# EAGLE design Zapalování_ARDUINO (EAGLE 7.5.0)
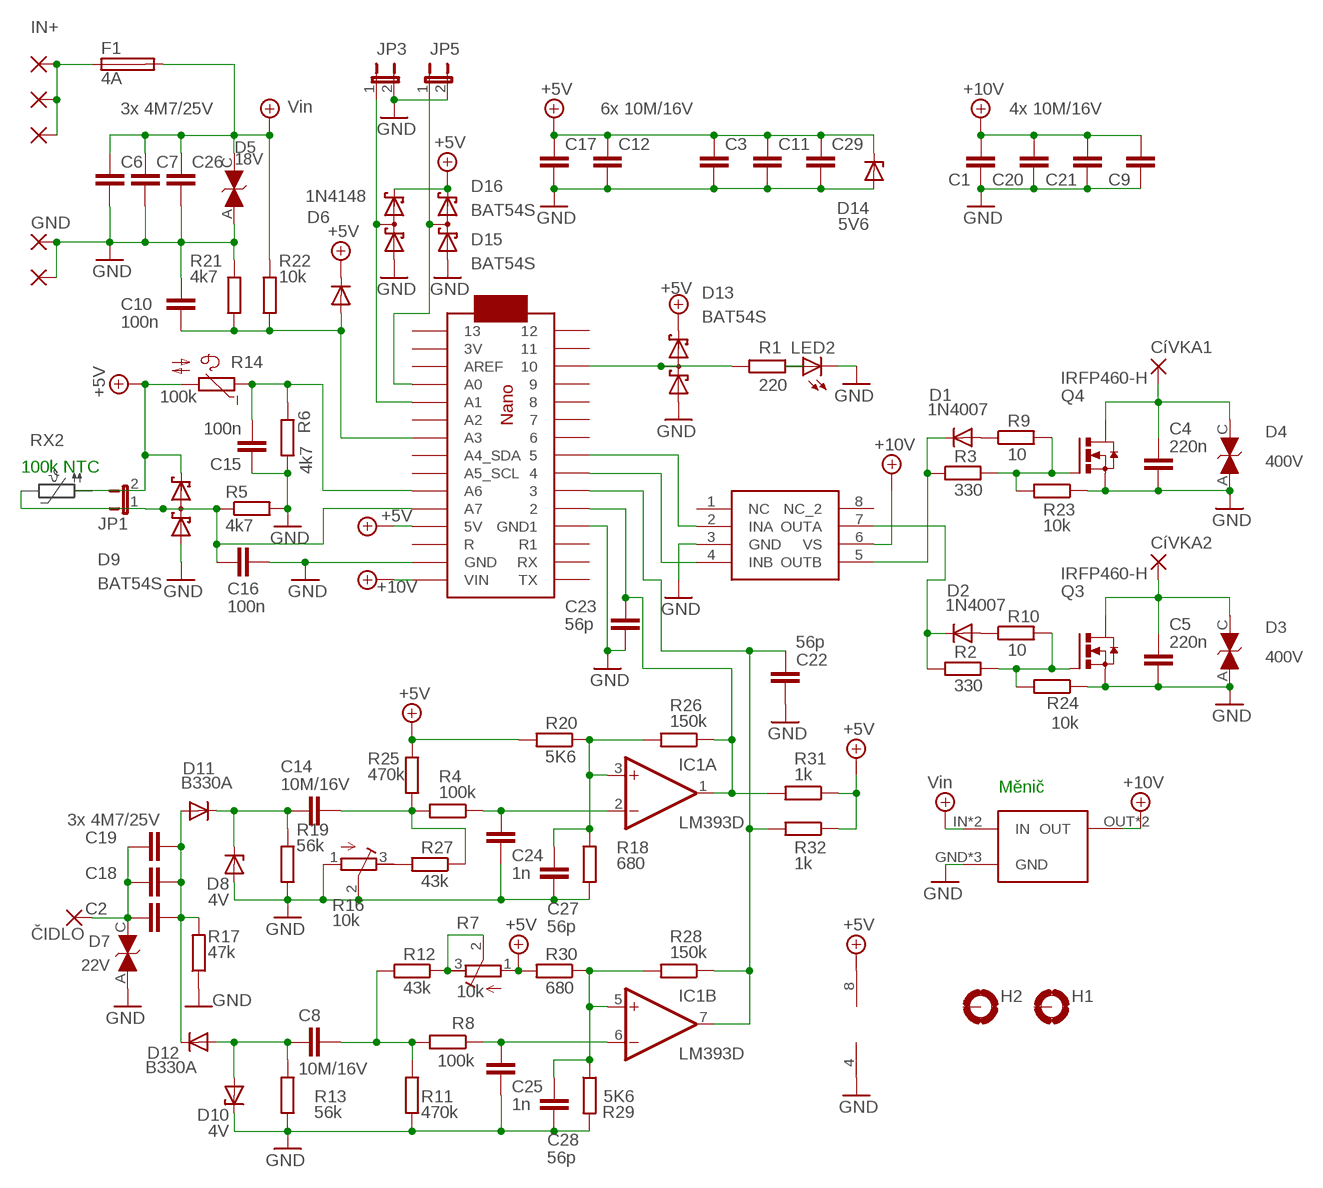
[diagram p0: schematic, sheet 1]

## Parts
C1  10M/16V  C-EUC1206K  [C1206K]
C2  3x 4M7/25V  C-EUC1206K  [C1206K]
C3  6x 10M/16V  C-EUC1206K  [C1206K]
C4  220n  C-EU150-054X183  [C150-054X183]
C5  220n  C-EU150-054X183  [C150-054X183]
C6  4M7/25V  C-EUC1206K  [C1206K]
C7  4M7/25V  C-EUC1206K  [C1206K]
C8  10M/16V  C-EUC1206K  [C1206K]
C9  10M/16V  C-EUC1206K  [C1206K]
C10  100n  C-EUC1206K  [C1206K]
C11  10M/16V  C-EUC1206K  [C1206K]
C12  10M/16V  C-EUC1206K  [C1206K]
C14  10M/16V  C-EUC1206K  [C1206K]
C15  100n  C-EUC1206K  [C1206K]
C16  100n  C-EUC1206K  [C1206K]
C17  10M/16V  C-EUC1206K  [C1206K]
C18  4M7/25V  C-EUC1206K  [C1206K]
C19  4M7/25V  C-EUC1206K  [C1206K]
C20  10M/16V  C-EUC1206K  [C1206K]
C21  4x 10M/16V  C-EUC1206K  [C1206K]
C22  56p  C-EUC1206K  [C1206K]
C23  56p  C-EUC1206K  [C1206K]
C24  1n  C-EUC1206K  [C1206K]
C25  1n  C-EUC1206K  [C1206K]
C26  3x 4M7/25V  C-EUC1206K  [C1206K]
C27  56p  C-EUC1206K  [C1206K]
C28  56p  C-EUC1206K  [C1206K]
C29  10M/16V  C-EUC1206K  [C1206K]
CIVKA+  3,81/1,4  [3,81/1,4]
CíVKA1  3,81/1,4  [3,81/1,4]
CíVKA2  3,81/1,4  [3,81/1,4]
CíVKA+  3,81/1,4  [3,81/1,4]
D1  1N4007  GF1  [SMA-DO214AC]
D2  1N4007  GF1  [SMA-DO214AC]
D3  400V  SMBJ  [SMC]
D4  400V  SMBJ  [SMC]
D5  18V  SMBJ  [SMC]
D6  1N4148  PMLL4150  [SOD80C]
D7  22V  SMBJ  [SMC]
D8  4V  ZENER-DIODESOD80C  [SOD80C]
D9  BAT54S  [SOT23]
D10  4V  ZENER-DIODESOD80C  [SOD80C]
D11  B330A  DIODE-DO214BA  [DO214BA]
D12  B330A  DIODE-DO214BA  [DO214BA]
D13  BAT54S  [SOT23]
D14  5V6  ZENER-DIODESOD80C  [SOD80C]
D15  BAT54S  [SOT23]
D16  BAT54S  [SOT23]
F1  4A  PICOFUSE  [PICOFUSE]
GND  3,81/1,4  [3,81/1,4]
GND28  3,81/1,4  [3,81/1,4]
H1  MOUNT-PAD-ROUND3.0  [3,0-PAD]
H2  MOUNT-PAD-ROUND3.0  [3,0-PAD]
IC1  LM393D  [SO08]
IN+  3,81/1,4  [3,81/1,4]
JP1  JP1E  [JP1]
JP3  JP1E  [JP1]
JP5  JP1E  [JP1]
LED2  LED5MM  [LED5MM]
Q3  IRFP460-H  IRFP240-H  [TO247BH]
Q4  IRFP460-H  IRFP240-H  [TO247BH]
R1  220  R-EU_M1206  [M1206]
R2  330  R-EU_M1206  [M1206]
R3  330  R-EU_M1206  [M1206]
R4  100k  R-EU_M1206  [M1206]
R5  4k7  R-EU_M1206  [M1206]
R6  4k7  R-EU_M1206  [M1206]
R7  10k  R-TRIMM64W  [RTRIM64W]
R8  100k  R-EU_M1206  [M1206]
R9  10  R-EU_M1206  [M1206]
R10  10  R-EU_M1206  [M1206]
R11  470k  R-EU_M1206  [M1206]
R12  43k  R-EU_M1206  [M1206]
R13  56k  R-EU_M1206  [M1206]
R14  100k  NTC640-9  [N640]
R16  10k  R-TRIMM64W  [RTRIM64W]
R17  47k  R-EU_M1206  [M1206]
R18  680  R-EU_M1206  [M1206]
R19  56k  R-EU_M1206  [M1206]
R20  5K6  R-EU_M1206  [M1206]
R21  4k7  R-EU_M1206  [M1206]
R22  10k  R-EU_M1206  [M1206]
R23  10k  R-EU_M1206  [M1206]
R24  10k  R-EU_M1206  [M1206]
R25  470k  R-EU_M1206  [M1206]
R26  150k  R-EU_M1206  [M1206]
R27  43k  R-EU_M1206  [M1206]
R28  150k  R-EU_M1206  [M1206]
R29  5K6  R-EU_M1206  [M1206]
R30  680  R-EU_M1206  [M1206]
R31  1k  R-EU_M1206  [M1206]
R32  1k  R-EU_M1206  [M1206]
U$1  ARDUINO_NANO  [ARDUINO_NANO]
U$2  IR25600/TC4427  IR23600  [SO08]
U$3  STEP:DOWN  [STEP-BOARD]
ČIDLO  3,81/1,4  [3,81/1,4]

## Nets
+5V: C3.1 C11.1 C12.1 C17.1 C29.1 D6.C D9.2(C2) D13.2(C2) D14.C D15.2(C2) D16.2(C2) IC1.8(P:V+) JP1.2 R7.1(A) R14.2 R20.2 R25.2 R30.2 R31.1 R32.1 U$1.P$23(5V)
+14V: C6.1 C7.1 C26.1 D5.C F1.2 R22.2 U$3.IN U$3.P$1(IN) ; supply symbol labelled Vin
+15V: C1.2 C9.1 C20.2 C21.2 U$1.P$20(VIN) U$2.6(VS) U$3.OUT U$3.P$2(OUT) ; supply symbol labelled +10V
CIVKA1: U$1.P$8 U$2.2(INA)
CIVKA2: U$1.P$9 U$2.4(INB)
GND: C1.1 C3.2 C4.2 C5.2 C6.2 C7.2 C9.2 C10.1 C11.2 C12.2 C15.1 C16.1 C17.2 C20.1 C21.1 C22.2 C23.2 C24.2 C25.2 C26.2 C27.2 C28.2 C29.2 D3.A D4.A D5.A D7.A D8.A D9.1(A1) D10.C D13.1(A1) D14.A D15.1(A1) D16.1(A1) GND28.1(P) GND.1(P) IC1.4(P:V-) JP3.2 JP5.2 LED2.K(C) Q3.S Q4.S R5.2 R6.2 R11.1 R13.1 R16.1(A) R16.2(S) R17.1 R18.1 R19.1 R21.2 R23.1 R24.1 R29.2 U$1.P$12(GND) U$1.P$21(GND1) U$2.3(GND) U$3.GND U$3.GND2(GND) U$3.P$3(GND)
INT1: C23.1 IC1.1(A:OUT) R26.1 R31.2 U$1.P$11
INT2: C22.1 IC1.7(B:OUT) R28.1 R32.2 U$1.P$10
N$1: Q4.G R3.2 R9.2 R23.2
N$3: D1.K(C) R3.1 U$2.5(OUTB)
N$4: C4.1 CíVKA1.1(P) D4.C Q4.D
N$5: Q3.G R2.2 R10.2 R24.2
N$6: D2.K(C) R2.1 U$2.7(OUTA)
N$7: D15.3(C1A2) JP3.1 U$1.P$30(A1)
N$8: D16.3(C1A2) JP5.1 U$1.P$31(A0)
N$9: D13.3(C1A2) R1.2 U$1.P$3
N$10: C16.2 D9.3(C1A2) JP1.1 R5.1 U$1.P$24(A7)
N$11: C28.1 IC1.5(B:+IN) R28.2 R29.1 R30.1
N$12: C24.1 IC1.2(A:-IN) R4.1
N$14: LED2.A R1.1
N$17: C27.1 IC1.3(A:+IN) R18.2 R20.1 R26.2
N$18: C2.2 C18.2 C19.2 D7.C ČIDLO.1(P)
N$19: C14.2 D8.C D11.C R19.2
N$21: C15.2 R6.1 R14.1 U$1.P$25(A6)
N$22: C2.1 C18.1 C19.1 D11.A D12.C R17.2
N$23: C25.1 IC1.6(B:-IN) R8.1
N$24: R7.2(S) R7.3(E) R12.1
N$25: C8.1 R8.2 R11.2 R12.2
N$26: R16.3(E) R27.2
N$27: C8.2 D10.A D12.A R13.2
N$29: D2.A R10.1
N$30: D1.A R9.1
N$35: C5.1 CíVKA2.1(P) D3.C Q3.D
N$38: C14.1 R4.2 R25.1 R27.1
N$45: C10.2 D6.A R21.1 R22.1 U$1.P$28(A3)
VIN: CIVKA+.1(P) CíVKA+.1(P) F1.1 IN+.1(P)
Unconnected: H1.B3,0(MOUNT) H2.B3,0(MOUNT) U$1.P$1 U$1.P$2 U$1.P$4 U$1.P$5 U$1.P$6 U$1.P$7 U$1.P$13(R) U$1.P$14(RX) U$1.P$15(TX) U$1.P$22(R1) U$1.P$26(A5_SCL) U$1.P$27(A4_SDA) U$1.P$29(A2) U$1.P$32(AREF) U$1.P$33(3V) U$1.P$34 U$2.1(NC) U$2.8(NC_2)

## Notes on the sheet
- 100k NTC
- Měnič

## Library data of the parts
C1-C12 C14-C29 = rcl:C-EU: CAPACITOR, European symbol
CIVKA+ CíVKA1 CíVKA2 CíVKA+ GND GND28 IN+ ČIDLO = wirepad:3,81/1,4: THROUGH-HOLE PAD
D1 D2 = diode:GF1: DIODE
D3-D5 D7 = transils:SMBJ: Transil SMC
D6 = diode:PMLL4150: DIODE high speed
D8 D10 D14 = diode:ZENER-DIODE: Z-Diode
D9 D13 D15 D16 = diode:BAT54S: Schottky Diodes Pin connection corrected 2011-05-04 Source: Fairchild .. BAT54.pdf
D11 D12 = diode:DIODE-: DIODE
F1 = fuse:PICOFUSE: PICOFUSE 19275, Wickmann; OC_FARNELL: unknown; OC_NEWARK: unknown
H1 H2 = holes:MOUNT-PAD-ROUND: MOUNTING PAD, round
IC1 = linear:LM393: COMPARATOR
JP1 JP3 JP5 = jumper:JP1E: JUMPER
LED2 = led:LED: LED OSRAM: - CHIPLED LG R971, LG N971, LY N971, LG Q971, LY Q971, LO R971, LY R971 LH N974, LH R974 LS Q976, LO Q976, LY Q976 LO Q996 - Hyper CHIPLED LW Q18S LB Q993, LB Q99A, LB R99A - SideLED LS A670, LO A670, LY A670, LG A670, LP A670 LB A673, LV A673, LT A673, LW A673 LH A674 LY A675 LS A676, LA A676, LO A676, LY A676, LW A676 LS A679, LY A679, LG A679 - Hyper Micro SIDELED® LS Y876, LA Y876, LO Y876, LY Y876 LT Y87S - SmartLED LW L88C, LW L88S LB L89C, LB L89S, LG L890 LS L89K, LO L89K, LY L89K LS L896, LA L896, LO L896, LY L896 - TOPLED LS T670, LO T670, LY T670, LG T670, LP T670 LSG T670, LSP T670, LSY T670, LOP T670, LYG T670 LG T671, LOG T671, LSG T671 LB T673, LV T673, LT T673, LW T673 LH T674 LS T676, LA T676, LO T676, LY T676, LB T676, LH T676, LSB T676, LW T676 LB T67C, LV T67C, LT T67C, LS T67K, LO T67K, LY T67K, LW E67C LS E67B, LA E67B, LO E67B, LY E67B, LB E67C, LV E67C, LT E67C LW T67C LS T679, LY T679, LG T679 LS T770, LO T770, LY T770, LG T770, LP T770 LB T773, LV T773, LT T773, LW T773 LH T774 LS E675, LA E675, LY E675, LS T675 LS T776, LA T776, LO T776, LY T776, LB T776 LHGB T686 LT T68C, LB T68C - Hyper Mini TOPLED® LB M676 - Mini TOPLED Santana® LG M470 LS M47K, LO M47K, LY M47K Source: http://www.osram.convergy.de LUXEON: - LUMILED® LXK2-PW12-R00, LXK2-PW12-S00, LXK2-PW14-U00, LXK2-PW14-V00 LXK2-PM12-R00, LXK2-PM12-S00, LXK2-PM14-U00 LXK2-PE12-Q00, LXK2-PE12-R00, LXK2-PE12-S00, LXK2-PE14-T00, LXK2-PE14-U00 LXK2-PB12-K00, LXK2-PB12-L00, LXK2-PB12-M00, LXK2-PB14-N00, LXK2-PB14-P00, LXK2-PB14-Q00 LXK2-PR12-L00, LXK2-PR12-M00, LXK2-PR14-Q00, LXK2-PR14-R00 LXK2-PD12-Q00, LXK2-PD12-R00, LXK2-PD12-S00 LXK2-PH12-R00, LXK2-PH12-S00 LXK2-PL12-P00, LXK2-PL12-Q00, LXK2-PL12-R00 Source: www.luxeon.com KINGBRIGHT: KA-3528ASYC Source: www.kingbright.com
Q3 Q4 = transistor-power:IRFP240: HEXFET Power MosFet Source: http://www.irf.com/
R1-R6 R8-R13 R17-R32 = rcl:R-EU_: RESISTOR, European symbol
R7 R16 = rcl:R-TRIMM: Trimm resistor
R14 = ptc-ntc:NTC640-9: PHILIPS NTC; OC_FARNELL: unknown; OC_NEWARK: unknown
U$1 = 00cmeldas:ARDUINO_NANO
U$2 = 00cmeldas:IR23600
U$3 = 00cmeldas:STEP:DOWN

## Board
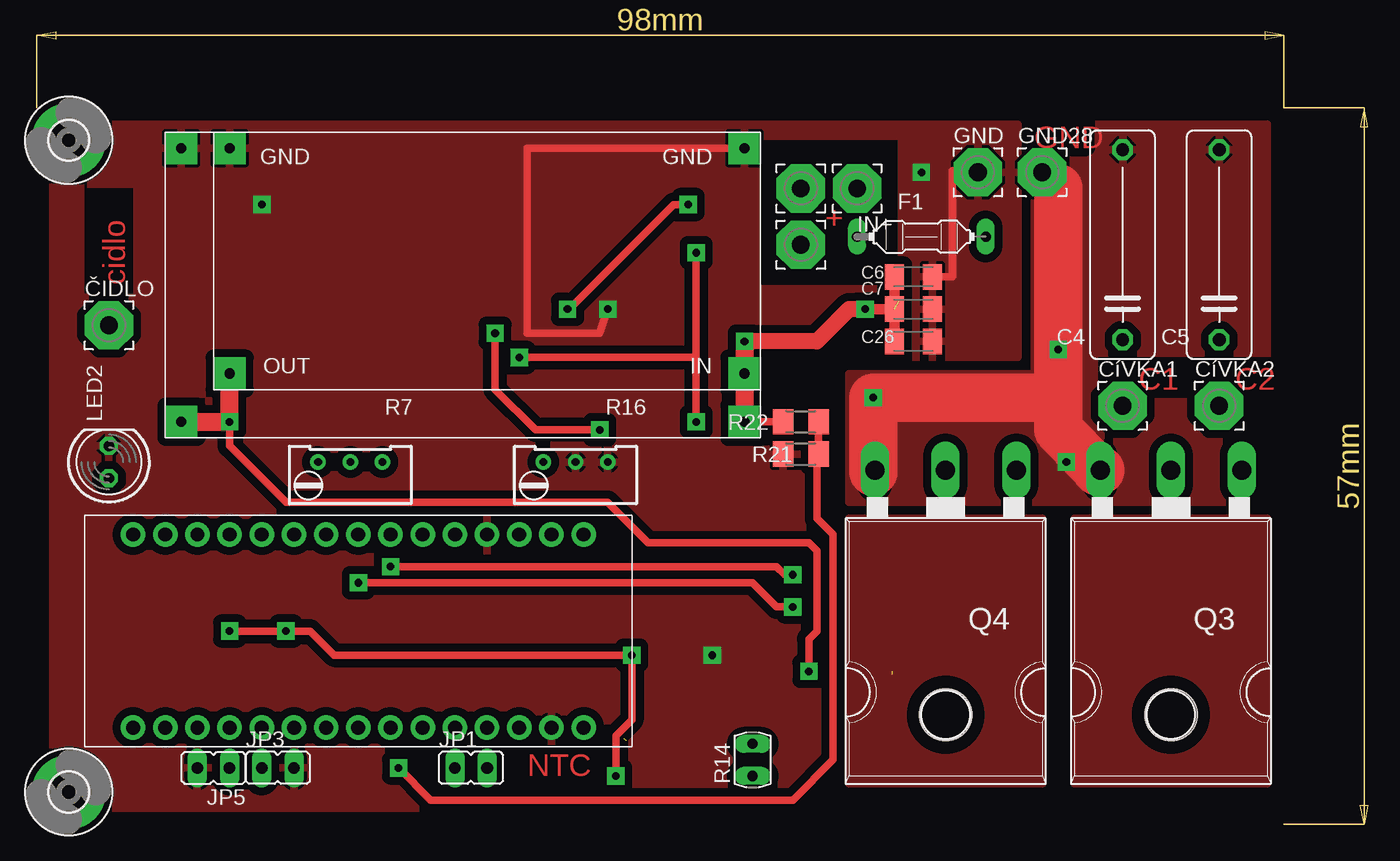
[diagram p1: board, top side]
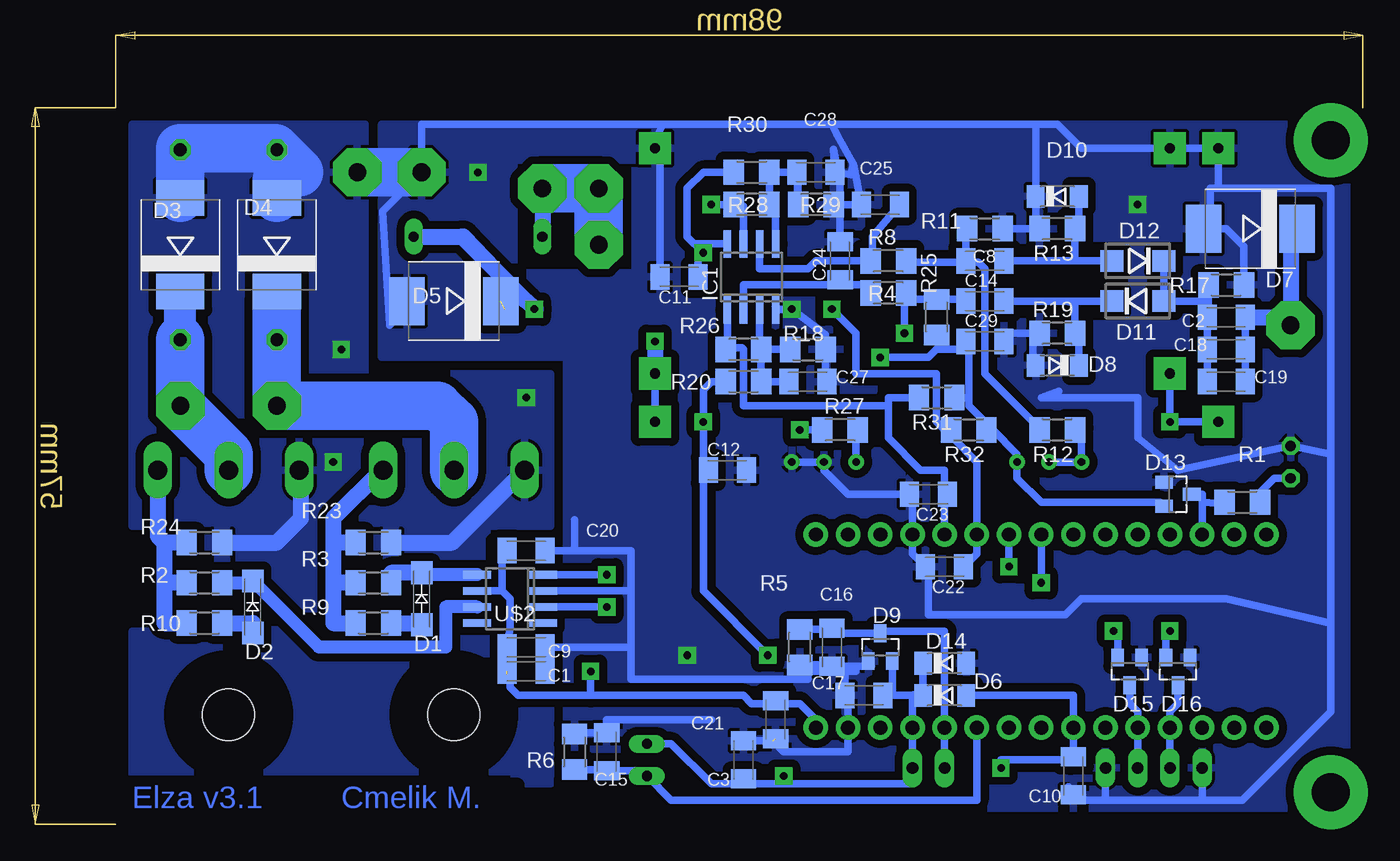
[diagram p2: board, bottom side, seen from below]

Size 105.07 x 62.53 mm. Coordinates in mm from the lower left corner, seen from the top.
Copper layers (1*16): Top 0.035mm / dielectric 1.5mm / Bottom 0.035mm
Design rules "default *": minimum track width 10mil, minimum drill 24mil, track to track 25mil, track to pad 35mil, pad to pad 12mil, via to via 12mil, smd to smd 8mil, copper to edge 40mil, drill to drill 8mil, minimum pad ring 12mil, minimum via ring 15mil, stop-mask expansion 4mil, vias tented up to drill 0mil, thermal gap 10mil
tRestrict: area 3.8,41.9 to 7.6,50.2; area 78.7,53.3 to 83.2,55.2; area 83.8,33.7 to 97.8,36.8; area 57.2,42.5 to 67.9,54
bRestrict: area 67.3,0.6 to 97.8,3.8; area 57.8,43.8 to 66.7,52.1

### Footprints (pad centres in the part's own frame; a part is rotated, then mirrored left to right if it is on the bottom)
C1206K = smd 1.5 x 2: 1 -1.5,0; 2 1.5,0
C150-054X183 = drill 1.016 octagon: 1 -7.493,0; 2 7.493,0
3,81/1,4 = drill 1.397 pad 3.81 octagon: 1 0,0
SMA-DO214AC = smd 1.8 x 1.7: A -2.05,0; K 2.05,0
SMC = smd 2.8 x 3.8: A 3.7,0; C -3.7,0
SOD80C = smd 1.4 x 1.8: A 1.7,0; C -1.7,0
SOT23 = smd 1 x 1.4: 1 -0.95,-1.1; 2 0.95,-1.1; 3 0,1.1
DO214BA = smd 1.8 x 1.7: A 2.05,0; C -2.05,0
PICOFUSE = drill 0.813 long: 1 -5.08,0; 2 5.08,0
3,0-PAD = drill 3 pad 5.842: B3,0 0,0
SO08 = smd 0.6 x 2.2: 1 -1.905,-2.6; 2 -0.635,-2.6; 3 0.635,-2.6; 4 1.905,-2.6; 5 1.905,2.6; 6 0.635,2.6; 7 -0.635,2.6; 8 -1.905,2.6
JP1 = drill 0.914 long: 1 0,-1.27; 2 0,1.27
LED5MM = drill 0.813 octagon: A -1.27,0; K 1.27,0
TO247BH = drill 1.499 long: D 0,-10.16; G -5.588,-10.16; S 5.588,-10.16 | hole 4.115: 0,9.144
M1206 = smd 1.6 x 2: 1 -1.4,0; 2 1.4,0
RTRIM64W = drill 0.61: 1 1.27,-2.54; 2 1.27,0; 3 1.27,2.54
N640 = drill 0.813 long: 1 -1.27,0; 2 1.27,0
ARDUINO_NANO = drill 1.1 pad 1.93: P$1 -20.32,7.62; P$2 -17.78,7.62; P$3 -15.24,7.62; P$4 -12.7,7.62; P$5 -10.16,7.62; P$6 -7.62,7.62; P$7 -5.08,7.62; P$8 -2.54,7.62; P$9 0,7.62; P$10 2.54,7.62; P$11 5.08,7.62; P$12 12.7,-7.62; P$13 10.16,-7.62; P$14 12.7,7.62; P$15 15.24,7.62; P$20 15.24,-7.62; P$21 7.62,7.62; P$22 10.16,7.62; P$23 7.62,-7.62; P$24 5.08,-7.62; P$25 2.54,-7.62; P$26 0,-7.62; P$27 -2.54,-7.62; P$28 -5.08,-7.62; P$29 -7.62,-7.62; P$30 -10.16,-7.62; P$31 -12.7,-7.62; P$32 -15.24,-7.62; P$33 -17.78,-7.62; P$34 -20.32,-7.62
SO08' = smd 0.6 x 2.2: 1 -1.905,-2.6; 2 -0.635,-2.6; 3 0.635,-2.6; 4 1.905,-2.6; 5 1.905,2.6; 6 0.635,2.6; 7 -0.635,2.6; 8 -1.905,2.6; 9 1.905,2.6
STEP-BOARD = drill 0.8 pad 2.54 square: GND -7.62,-7.62; GND2 33.02,-7.62; IN -7.62,10.16; OUT 33.02,10.16; P$1 -7.62,13.97; P$2 36.83,13.97; P$3 36.83,-7.62

### Placement (x,y rotation side)
C1  66.04,13.97 180 bottom
C2  10.8,40.01 0 bottom
C3  48.9,5.08 90 bottom
C4  85.72,45.72 90 top
C5  93.34,45.72 90 top
C6  69.21,43.18 0 top
C7  69.21,40.64 0 top
C8  29.84,44.45 0 bottom
C9  66.04,12.06 0 bottom
C10  22.86,3.81 90 bottom
C11  53.98,43.18 180 bottom
C12  50.16,27.94 0 bottom
C14  29.84,41.27 0 bottom
C15  59.69,5.71 270 bottom
C16  41.91,13.97 90 bottom
C17  39.37,10.16 180 bottom
C18  10.8,37.47 0 bottom
C19  10.8,34.92 0 bottom
C20  66.04,21.59 180 bottom
C21  46.36,8.26 90 bottom
C22  33.02,20.32 180 bottom
C23  34.29,26.04 180 bottom
C24  41.27,44.45 90 bottom
C25  38.1,48.9 180 bottom
C26  69.21,38.1 0 top
C27  43.81,34.92 0 bottom
C28  43.18,51.44 0 bottom
C29  29.84,38.1 0 bottom
CIVKA+  60.33,50.16 0 top
CíVKA1  85.72,33.02 0 top
CíVKA2  93.34,33.02 0 top
CíVKA+  60.33,45.72 0 top
D1  74.29,17.78 90 bottom
D2  87.63,17.14 90 bottom
D3  93.34,45.72 90 bottom
D4  85.72,45.72 90 bottom
D5  71.75,41.27 180 bottom
D6  33.02,10.16 0 bottom
D7  8.89,46.99 180 bottom
D8  24.13,36.2 180 bottom
D9  38.1,13.97 0 bottom
D10  24.13,49.53 0 bottom
D11  17.78,41.27 0 bottom
D12  17.78,44.45 180 bottom
D13  14.61,26.04 270 bottom
D14  33.02,12.7 0 bottom
D15  18.41,12.06 180 bottom
D16  14.61,12.06 180 bottom
F1  69.85,46.35 0 top
GND  74.29,51.44 0 top
GND28  79.38,51.44 0 top
H1  2.54,53.98 0 top
H2  2.54,2.54 0 top
IC1  48.26,43.18 0 bottom
IN+  64.77,50.16 0 top
JP1  34.29,4.45 270 top
JP3  19.05,4.45 270 top
JP5  13.97,4.45 90 top
LED2  5.72,28.57 90 top
Q3  89.53,17.78 180 top
Q4  71.75,17.78 180 top
R1  9.52,25.4 180 bottom
R2  91.44,19.05 180 bottom
R3  78.1,19.05 180 bottom
R4  37.47,41.91 0 bottom
R5  44.45,13.97 270 bottom
R6  62.23,5.71 90 bottom
R7  24.77,27.3 90 top
R8  37.47,44.45 0 bottom
R9  78.1,15.88 180 bottom
R10  91.44,15.88 180 bottom
R11  29.84,46.99 180 bottom
R12  24.13,31.11 180 bottom
R13  24.13,46.99 0 bottom
R14  56.52,5.08 90 top
R16  42.55,27.3 90 top
R17  10.8,42.55 180 bottom
R18  43.81,37.47 180 bottom
R19  24.13,38.73 0 bottom
R20  48.9,34.92 180 bottom
R21  60.33,29.21 180 top
R22  60.33,31.75 180 top
R23  78.1,22.23 180 bottom
R24  91.44,22.23 180 bottom
R25  33.66,40.01 270 bottom
R26  48.9,37.47 0 bottom
R27  41.27,31.11 0 bottom
R28  48.26,48.9 0 bottom
R29  43.18,48.9 0 bottom
R30  48.26,51.44 180 bottom
R31  33.66,33.66 180 bottom
R32  31.12,31.11 180 bottom
U$1  27.94,15.24 0 top
U$2  IR25600/TC4427  [SO08']  67.31,17.78 90 bottom
U$3  48.26,45.72 180 top
ČIDLO  5.72,39.37 0 top

### Tracks (layer width: path | path; a pad name or v marks a point on that pad's centre or on a via)
+5V  (via drill 0.6)
  Top 0.61: v45.72,3.81 45.72,6.99 46.99,8.26 v46.99,13.34 23.5,13.34 21.59,15.24 v19.69,15.24 v15.24,15.24 | v38.1,36.83 52.07,36.83 | v52.07,45.09 52.07,36.83 | 52.07,36.83 v52.07,31.75
  Bottom 0.61: C17.1 37.47,10.16 | 35.71,10.16 35.56,10.16 | 35.71,10.16 37.47,10.16 | 37.47,10.16 37.15,10.48 D9.2 | 45.72,3.17 35.56,3.17 JP1.2 | 45.72,3.17 48.9,3.17 | 48.9,3.17 C3.1 | C3.1 48.9,3.81 | 35.56,10.16 D6.C D14.C | 35.71,10.16 35.08,10.31 | 48.9,3.17 51.44,3.17 54.61,6.35 R14.2 | v45.72,3.81 45.72,3.17 | 33.66,37.47 34.29,36.83 v38.1,36.83 | 52.07,27.94 v52.07,31.75 52.07,34.29 51.44,34.92 R20.2 | 52.07,27.94 52.07,18.41 v46.99,13.34 | JP1.2 35.56,5.08 | R25.2 33.52,38.6 | 33.52,38.6 33.66,38.73 | 33.52,38.6 33.02,38.1 33.66,37.47 | 33.66,37.47 31.75,37.47 C29.1 31.12,37.7 31.12,33.66 | 35.56,10.16 U$1.P$23 JP1.2 | C3.1 49.12,3.58 49.53,3.17 51.03,3.17 | 31.12,33.66 31.12,33.02 29.84,31.75 R32.1 29.21,31.11 27.3,29.21 R7.1 27.3,27.3 25.4,25.4 16.02,25.4 D13.2 | IC1.8 52.65,45.78 v52.07,45.09 | R30.2 52.07,51.44 53.34,50.16 53.34,46.35 v52.07,45.09 | C11.1 52.48,45.31 v52.07,45.09 | R31.1 31.12,33.66 | C12.1 52.07,27.94 | D15.2 19.37,14.92 v19.69,15.24 | D16.2 15.55,14.93 v15.24,15.24
+14V  (via drill 0.6)  (1 unrouted)
  Top 0.61: 59.05,31.75 R22.2 U$3.P$1
  Top 0.813: C26.1 C7.1 | C7.1 C6.1 | C7.1 v65.4,40.64
  Top 1.27: v65.4,40.64 64.13,40.64 61.6,38.1 v55.88,38.1
  Top 1.422: v55.88,38.1 U$3.IN U$3.P$1
  Bottom 0.61: U$3.P$1 U$3.IN
  Bottom 1.27: v65.4,40.64 65.27,40.64 66.04,41.27 68.58,43.81 | v55.88,38.1 U$3.IN | 71.12,46.35 70.99,46.35 68.58,43.81 | F1.2 71.12,46.35 | 68.58,43.81 71.12,46.35
+15V  (via drill 0.6)  (1 unrouted)
  Top 0.61: v15.24,31.75 15.24,29.84 19.69,25.4 45.09,25.4 48.26,22.23 60.96,22.23 61.6,21.59 61.6,15.24 60.96,14.61 v60.96,12.06
  Top 1.422: U$3.P$2 v15.24,31.75 U$3.OUT
  Bottom 0.61: 45.49,9.53 48.26,9.53 48.9,10.16 49.53,10.16 60.96,10.16 | 60.96,10.16 66.67,10.16 67.31,10.79 67.31,11.2 67.54,11.84 | 67.94,18.41 67.31,17.78 67.31,15.47 C1.2 C9.1 | 67.94,18.41 U$2.6 | C20.2 67.94,21.18 67.94,18.41 | C21.2 45.49,9.53 | 45.49,9.53 44.45,9.53 43.18,8.26 U$1.P$20 | U$3.OUT v15.24,31.75 U$3.P$2 | v60.96,12.06 60.96,10.16
CIVKA1  (via drill 0.6 pad 0.61)
  Top 0.61: v25.4,19.05 56.52,19.05 58.42,17.14 v59.69,17.14
  Bottom 0.61: U$1.P$8 v25.4,19.05 | v59.69,17.14 U$2.2
CIVKA2  (via drill 0.6 pad 0.61)
  Top 0.61: v59.69,19.68 59.05,19.68 58.42,20.32 v27.94,20.32
  Bottom 0.61: U$2.4 v59.69,19.68 | v27.94,20.32 U$1.P$9
GND  (via drill 0.6)  (1 unrouted)
  Top 0.61: C6.2 72.28,43.18 72.28,51.55 GND.1 | v45.09,40.64 44.45,38.73 38.73,38.73 38.73,53.34 U$3.GND
  Top 3.81: 80.64,31.11 83.82,27.94 83.82,27.81 | 83.82,27.81 Q3.S | 83.82,27.81 80.64,31.11 | 80.64,31.11 80.64,33.66 | 80.64,33.66 v66.04,33.66 66.04,27.81 | 80.64,33.66 v80.64,37.47 80.64,50.16
  Bottom 0.61: 26.04,38.73 27.94,38.73 28.35,38.33 C29.2 | R6.2 62.13,7.21 C15.1 59.69,8.26 51.44,8.26 | D9.1 38.81,12.47 C16.1 40.23,12.47 40.64,12.06 | D5.A 75.56,40.64 76.83,39.37 77.36,48.37 GND.1 74.29,55.24 55.24,55.24 | 57.79,13.97 C1.1 C9.2 | 57.79,13.97 57.79,18.41 | 57.79,18.41 57.79,21.59 62.23,21.59 | 62.23,21.59 62.23,24.02 | 40.01,12.06 40.64,12.06 | 40.64,12.06 43.81,12.06 | 57.79,13.97 57.79,11.43 43.81,11.43 43.81,12.06 | C20.1 62.23,21.59 | JP3.2 20.32,1.91 | 20.32,1.91 12.7,1.91 | 12.7,1.91 JP5.2 | 12.7,1.91 9.52,1.91 2.54,8.89 2.54,15.88 | 2.54,15.88 2.54,29.21 | 2.54,29.21 2.54,50.16 11.43,50.16 | D7.A 12.38,47.12 | 12.38,47.12 12.07,46.35 12.07,50.16 11.43,50.16 | 11.43,50.16 U$3.P$3 U$3.GND2 22.23,53.34 24.13,55.24 26.04,55.24 | R17.1 9.39,45.59 10.8,46.99 12.25,46.99 12.38,47.12 | R19.1 26.04,38.73 | 26.04,38.73 26.04,36.4 D8.A | D10.C 25.83,47.29 R13.1 | D10.C 25.83,47.42 25.4,46.99 R11.1 28.35,47.09 | C3.2 46.59,6.58 45.72,5.71 40.64,5.71 U$1.P$12 40.64,9.12 C17.2 40.87,11.84 40.64,12.06 | D10.C 25.83,55.04 26.04,55.24 | 55.24,55.24 55.88,53.98 U$3.GND 55.48,52.94 C11.2 | 55.24,55.24 41.91,55.24 | 41.91,55.24 26.04,55.24 | C10.1 23.27,2.94 22.23,1.91 20.32,1.91 | R5.2 43.05,12.57 43.81,12.06 | C22.2 35.56,21.36 U$1.P$21 35.56,25.8 C23.2 40.64,26.04 42.55,27.94 R16.2 R16.1 | U$2.3 57.79,18.41 | 24,34.16 25.4,33.66 17.78,33.66 17.78,30.48 14.61,27.94 LED2.K 2.54,29.21 | 41.27,48.9 C25.2 40.23,52.07 | 41.27,48.9 41.27,46.18 41.51,46.18 C24.2 | 40.23,52.07 41.51,54.38 41.91,55.24 | IC1.4 46.3,40.64 v45.09,40.64 42.41,38.6 R18.1 42.41,35.02 C27.2 | R29.2 41.27,48.9 | 41.27,48.9 41.27,50.8 41.78,53.24 C28.2 40.41,51.26 40.23,52.07
  Bottom 0.61: 2.54,15.88 10.8,17.78 22.23,17.78 23.5,16.51 34.29,16.51 34.29,20.32
  Bottom 1.27: 66.04,27.18 Q4.S 71.88,22.23 R23.1 | R24.1 85.72,22.23 83.82,24.13 83.82,27.81 Q3.S
  Bottom 2.54: C5.2 D3.A
  Bottom 3.81: GND28.1 GND.1 | C4.2 83.95,51.44 85.09,51.44 85.72,50.8 D4.A | D3.A 93.34,53.34 85.85,53.34
  other vias: 69.85,51.44 53.34,13.34 17.78,48.9 81.28,28.57
  pour Top: 64.13,25.4 97.15,25.4 97.15,55.24 78.74,55.24 78.74,35.56 64.13,35.56
  pour Top: 1.27,1.27 60.96,1.27 62.87,3.17 62.87,36.83 77.47,36.83 77.47,55.24 1.27,55.24
  pour Bottom: 1.27,1.27 62.87,1.27 62.87,36.83 77.47,36.83 77.47,55.24 1.27,55.24
  pour Bottom: 64.13,23.5 97.15,23.5 97.15,55.24 78.74,55.24 78.74,35.56 64.13,35.56
  pour Bottom: 69.21,23.5 97.15,23.5 97.15,13.97 69.85,13.97 69.85,22.86
INT1
  Bottom 0.61: U$1.P$11 33.02,26.04 | 33.02,26.04 C23.1 | 33.02,26.04 33.02,27.94 34.93,27.94 37.47,30.48 37.47,33.02 | IC1.1 50.16,37.59 | 50.16,37.59 R26.1 | 50.16,37.59 49.02,37.59 48.9,37.47 48.9,33.02 37.47,33.02 | R31.2 37.47,33.66 37.47,33.02
INT2  (via drill 0.6)
  Top 0.61: v41.91,40.64 42.04,40.64 50.3,48.9 v51.44,48.9
  Bottom 0.61: C22.1 30.48,21.36 U$1.P$10 30.48,28.57 32.38,30.48 | IC1.7 48.9,48.77 R28.1 v51.44,48.9 | v41.91,40.64 40.01,38.73 40.01,35.56 33.66,35.56 33.66,31.75 32.38,30.48 | 32.38,30.48 32.38,30.98 R32.2
N$1
  Bottom 1.27: Q4.G 77.34,27.43 77.47,27.94 81.28,24.13 81.28,22.23 | R23.2 81.28,22.23 | 81.28,22.23 81.28,19.05 | R3.2 81.28,19.05 | 81.28,19.05 81.28,15.88 R9.2
N$2
  pour Top: 64.13,24.13 79.38,24.13 79.38,3.17 64.13,3.17
N$3
  Bottom 1.016: U$2.5 73.52,19.68 D1.K
  Bottom 1.27: R3.1 76.7,19.83 D1.K 74.29,19.68
N$4
  Bottom 1.778: D4.C 85.72,41.27
  Bottom 3.81: Q4.D 71.75,31.75 73.02,33.02 CíVKA1.1 C4.1 85.72,41.27
N$5
  Bottom 1.27: Q3.G 95.12,22.73 94.61,22.23 | R24.2 94.61,22.23 | 94.61,22.23 94.61,19.05 | R2.2 94.61,19.05 | 94.61,19.05 94.61,15.88 R10.2
N$6
  Bottom 1.016: R2.1 87.77,19.05 D2.K 82.4,13.97 72.39,13.97 72.39,17.14 U$2.7
N$7
  Bottom 0.61: JP3.1 U$1.P$30 17.78,8.89 18.41,9.53 D15.3
N$8
  Bottom 0.61: JP5.1 U$1.P$31 15.24,8.89 14.61,9.53 D16.3
N$9
  Bottom 0.61: R1.2 10.93,25.27 12.7,25.4 | 12.7,25.4 U$1.P$3 | D13.3 12.7,26.04 12.7,25.4
N$10
  Bottom 0.61: R5.1 41.91,15.37 C16.2 42.15,15.07 D9.3 37.93,15.24 33.02,15.24 U$1.P$24 JP1.1
N$11
  Bottom 0.61: IC1.5 46.36,48.77 | 46.36,48.77 R28.2 | 46.36,48.77 46.86,49.27 R30.1 44.45,51.44 44.58,51.3 R29.1 44.58,48.8 C28.1
N$12
  Bottom 0.61: R4.1 39.37,42.55 40.64,42.55 | 40.64,42.55 48.9,42.55 IC1.2 | C24.1 41.05,42.95 40.64,42.55
N$14
  Bottom 0.61: LED2.A 6.99,27.3 8.25,26.04 8.25,25.53 R1.1
N$15
  pour Top: 81.91,24.13 97.15,24.13 97.15,3.17 81.91,3.17
N$17
  Bottom 0.61: IC1.3 47.62,37.59 R26.2 | R18.2 R26.2 | R26.2 R20.1 C27.1
N$18
  Bottom 0.61: 5.72,46.35 D7.C | C19.2 C18.2 C2.2
  Bottom 1.27: 5.72,46.35 5.72,40.01 | 5.72,40.01 ČIDLO.1 | C2.2 5.72,40.01
N$19
  Bottom 0.61: D11.C 23.5,41.27 | 23.5,41.27 C14.2 | D8.C 22.43,39.07 R19.2 22.73,41.15 23.5,41.27
N$20
  pour Bottom: 64.13,3.17 97.15,3.17 97.15,15.24 64.13,15.88
N$21
  Bottom 0.61: U$1.P$25 30.48,1.91 54.61,1.91 R14.1 56.74,4.21 C15.2 59.79,4.32 R6.1
N$22
  Bottom 0.61: C19.1 C18.1 C2.1 12.2,40.74 12.2,41.27 | R17.2 12.2,41.27 | D12.C D11.A 12.2,41.27
N$23
  Bottom 0.61: IC1.6 47.62,43.81 43.81,43.81 43.18,44.45 R8.1 39.14,44.17 38.73,45.09 38.73,46.35 C25.1
N$24
  Bottom 0.61: R12.1 22.23,31.25 R7.3 R7.2
N$25
  Bottom 0.61: R11.2 31.34,46.89 C8.1 31.48,44.32 | 35.94,44.32 R8.2 36.06,44.32 31.48,44.32 | 31.48,44.32 30.35,44.32 29.84,43.81 29.84,35.56 26.04,31.75 R12.2
N$26
  Bottom 0.61: R16.3 40.01,30.98 R27.2
N$27
  Bottom 0.61: D12.A 22.86,44.45 | 22.86,44.45 C8.2 | D10.A 22.43,47.29 R13.2 22.73,44.58 22.86,44.45
N$29
  Bottom 1.27: R10.1 87.63,15.88 D2.A
N$30
  Bottom 1.27: R9.1 74.29,15.88 D1.A
N$35
  Bottom 2.54: C5.1 D3.C
  Bottom 3.81: C5.1 CíVKA2.1 89.53,29.21 Q3.D
N$38  (via drill 0.6)
  Top 0.61: v44.45,31.11 39.37,31.11 36.2,34.29 v36.2,38.73
  Bottom 0.61: 31.34,40.74 C14.1 31.48,41.41 R25.1 35.94,41.41 R4.2 36.2,41.15 v36.2,38.73 | R27.1 v44.45,31.11
N$45  (via drill 0.6 pad 0.61)
  Top 0.61: v28.57,4.45 31.12,1.91 59.69,1.91 62.87,5.08 62.87,22.86 61.6,24.13 61.6,29.21 R21.1 R22.1
  Bottom 0.61: D6.A 22.86,10.16 U$1.P$28 22.86,5.08 23.5,5.08 | v28.57,4.45 28.57,5.08 23.5,5.08 | C10.2 23.09,4.85 23.5,5.08
VIN
  Bottom 1.27: IN+.1 F1.1
  Bottom 3.81: CíVKA+.1 CIVKA+.1 IN+.1

### Text on the board
Top: GND | + | cidlo | C1 | C2 | NTC
Bottom: Cmelik M. | Elza v3.1